# EAGLE design led-ring (EAGLE 9.4.2)
DATUM: 01.07.2019; EDITOR: Hans Achterbahn; LICENSE: MIT License; PROJEKT: LED Ring; VERSION: 0.1.0
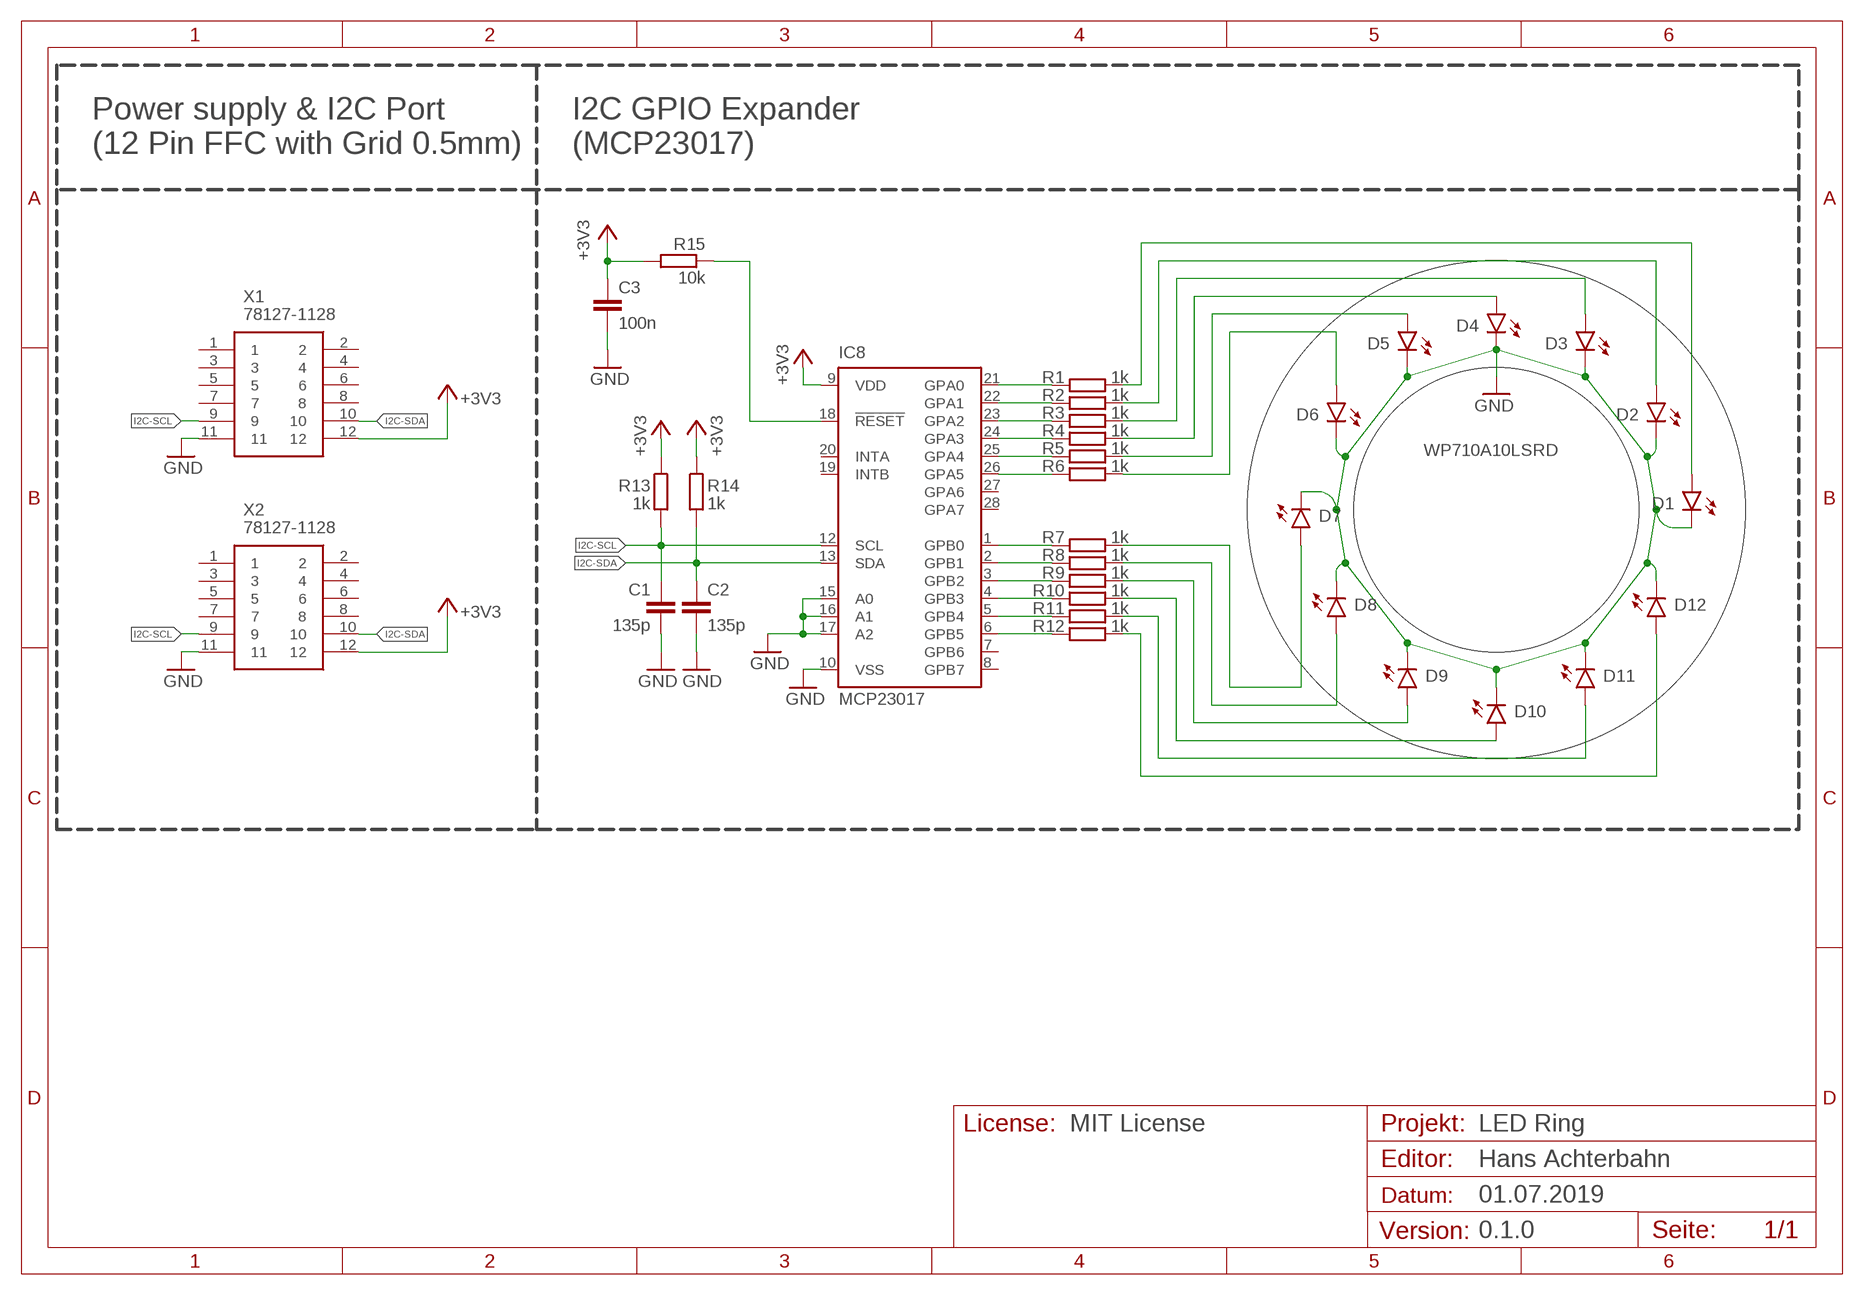
[diagram p0: schematic, sheet 1]

## Parts
C1  135p  C-EUC0603  [C0603]
C2  135p  C-EUC0603  [C0603]
C3  100n  C-EUC0603  [C0603]
D1  WP710A10LSRD  LTL-1CHE  [RADIAL_3MM]
D2  WP710A10LSRD  LTL-1CHE  [RADIAL_3MM]
D3  WP710A10LSRD  LTL-1CHE  [RADIAL_3MM]
D4  WP710A10LSRD  LTL-1CHE  [RADIAL_3MM]
D5  WP710A10LSRD  LTL-1CHE  [RADIAL_3MM]
D6  WP710A10LSRD  LTL-1CHE  [RADIAL_3MM]
D7  WP710A10LSRD  LTL-1CHE  [RADIAL_3MM]
D8  WP710A10LSRD  LTL-1CHE  [RADIAL_3MM]
D9  WP710A10LSRD  LTL-1CHE  [RADIAL_3MM]
D10  WP710A10LSRD  LTL-1CHE  [RADIAL_3MM]
D11  WP710A10LSRD  LTL-1CHE  [RADIAL_3MM]
D12  WP710A10LSRD  LTL-1CHE  [RADIAL_3MM]
IC8  MCP23017  [SOP65P780X200-28]
R1  1k  R-EU_R0603  [R0603]
R2  1k  R-EU_R0603  [R0603]
R3  1k  R-EU_R0603  [R0603]
R4  1k  R-EU_R0603  [R0603]
R5  1k  R-EU_R0603  [R0603]
R6  1k  R-EU_R0603  [R0603]
R7  1k  R-EU_R0603  [R0603]
R8  1k  R-EU_R0603  [R0603]
R9  1k  R-EU_R0603  [R0603]
R10  1k  R-EU_R0603  [R0603]
R11  1k  R-EU_R0603  [R0603]
R12  1k  R-EU_R0603  [R0603]
R13  1k  R-EU_R0603  [R0603]
R14  1k  R-EU_R0603  [R0603]
R15  10k  R-EU_R0603  [R0603]
X1  78127-1128  [781271128]
X2  78127-1128  [781271128]

## Nets
+3V3: C3.1 IC8.9(VDD) R13.1 R14.1 R15.2 X1.12 X2.12
GND: C1.2 C2.2 C3.2 D1.C D2.C D3.C D4.C D5.C D6.C D7.C D8.C D9.C D10.C D11.C D12.C IC8.10(VSS) IC8.15(A0) IC8.16(A1) IC8.17(A2) X1.11 X2.11
I2C-SCL: C1.1 IC8.12(SCL) R13.2 X1.9 X2.9
I2C-SDA: C2.1 IC8.13(SDA) R14.2 X1.10 X2.10
LED-01: D1.A R1.1
LED-02: D2.A R2.1
LED-03: D3.A R3.1
LED-04: D4.A R4.1
LED-05: D5.A R5.1
LED-06: D6.A R6.1
LED-07: D7.A R7.1
LED-08: D8.A R8.1
LED-09: D9.A R9.1
LED-10: D10.A R10.1
LED-11: D11.A R11.1
LED-12: D12.A R12.1
N$1: IC8.26(GPA5) R6.2
N$2: IC8.21(GPA0) R1.2
N$3: IC8.22(GPA1) R2.2
N$4: IC8.23(GPA2) R3.2
N$5: IC8.24(GPA3) R4.2
N$6: IC8.25(GPA4) R5.2
N$7: IC8.1(GPB0) R7.2
N$8: IC8.2(GPB1) R8.2
N$9: IC8.3(GPB2) R9.2
N$10: IC8.4(GPB3) R10.2
N$11: IC8.5(GPB4) R11.2
N$12: IC8.6(GPB5) R12.2
N$213: IC8.18(!RESET) R15.1
Unconnected: IC8.7(GPB6) IC8.8(GPB7) IC8.19(INTB) IC8.20(INTA) IC8.27(GPA6) IC8.28(GPA7) X1.1 X1.2 X1.3 X1.4 X1.5 X1.6 X1.7 X1.8 X2.1 X2.2 X2.3 X2.4 X2.5 X2.6 X2.7 X2.8

## Notes on the sheet
- Power supply & I2C Port
  (12 Pin FFC with Grid 0.5mm)
- I2C GPIO Expander
  (MCP23017)
- License:

## Library data of the parts
C1 C2 = rcl:C-EU: CAPACITOR, European symbol; SPICEPREFIX: C
C3 = rcl:C-EU: CAPACITOR, European symbol; MF: AVX; MFN: 0603YC104JAT2A; MOUSER: 581-0603YC104J; RS-ONLINE: 391-246; SPICEPREFIX: C
D1-D12 = LED:LTL-1CHE: LED RED DIFFUSED T/H Manufacturer's datasheet <https://media.digikey.com/pdf/Data%20Sheets/Lite-On%20PDFs/LTL-1CHEE.pdf>; CREATED_BY: PCBLayout.com; DIGIKEY_PART_NUMBER: 160-1708-ND; MANUFACTURER: Lite-On Inc.; MPN: LTL-1CHE; PACKAGE: RADIAL 3MM
IC8 = JS-ICs:MCP23017; MF: Microchip; MFN: MCP23017-E/SS; MOUSER: 579-MCP23017-E/SS; RS-ONLINE: 681-1128
R1-R14 = rcl:R-EU_: RESISTOR, European symbol; SPICEPREFIX: R
R15 = rcl:R-EU_: RESISTOR, European symbol; MF: Vishay; MFN: CRCW060310K0FKEA; MOUSER: 71-CRCW0603-10K-E3; RS-ONLINE: 678-9667; SPICEPREFIX: R
X1 X2 = h8-conector:78127-1128: FFC & FPC Connectors 0.5 FPC CONN. VERTIC AL SMT NON-ZIF 12CKT Source: Datasheet <https://www.molex.com/pdm_docs/sd/781271128_sd.pdf>; ALLIED_NUMBER: 70714305; ALLIED_PRICE-STOCK: https://www.alliedelec.com/molex-incorporated-78127-1128/70714305/; DESCRIPTION: FFC & FPC Connectors 0.5 FPC CONN. VERTIC AL SMT NON-ZIF 12CKT; HEIGHT: 4mm; MANUFACTURER_NAME: Molex; MANUFACTURER_PART_NUMBER: 78127-1128; MOUSER_PART_NUMBER: 538-78127-1128; MOUSER_PRICE-STOCK: https://www.mouser.com/Search/Refine.aspx?Keyword=538-78127-1128

## Net classes
0 default: width 0.2 mm, drill 0.2 mm, clearance 0.15 mm
1 Power: width 0.2 mm, drill 0.2 mm, clearance 0.15 mm

## Board
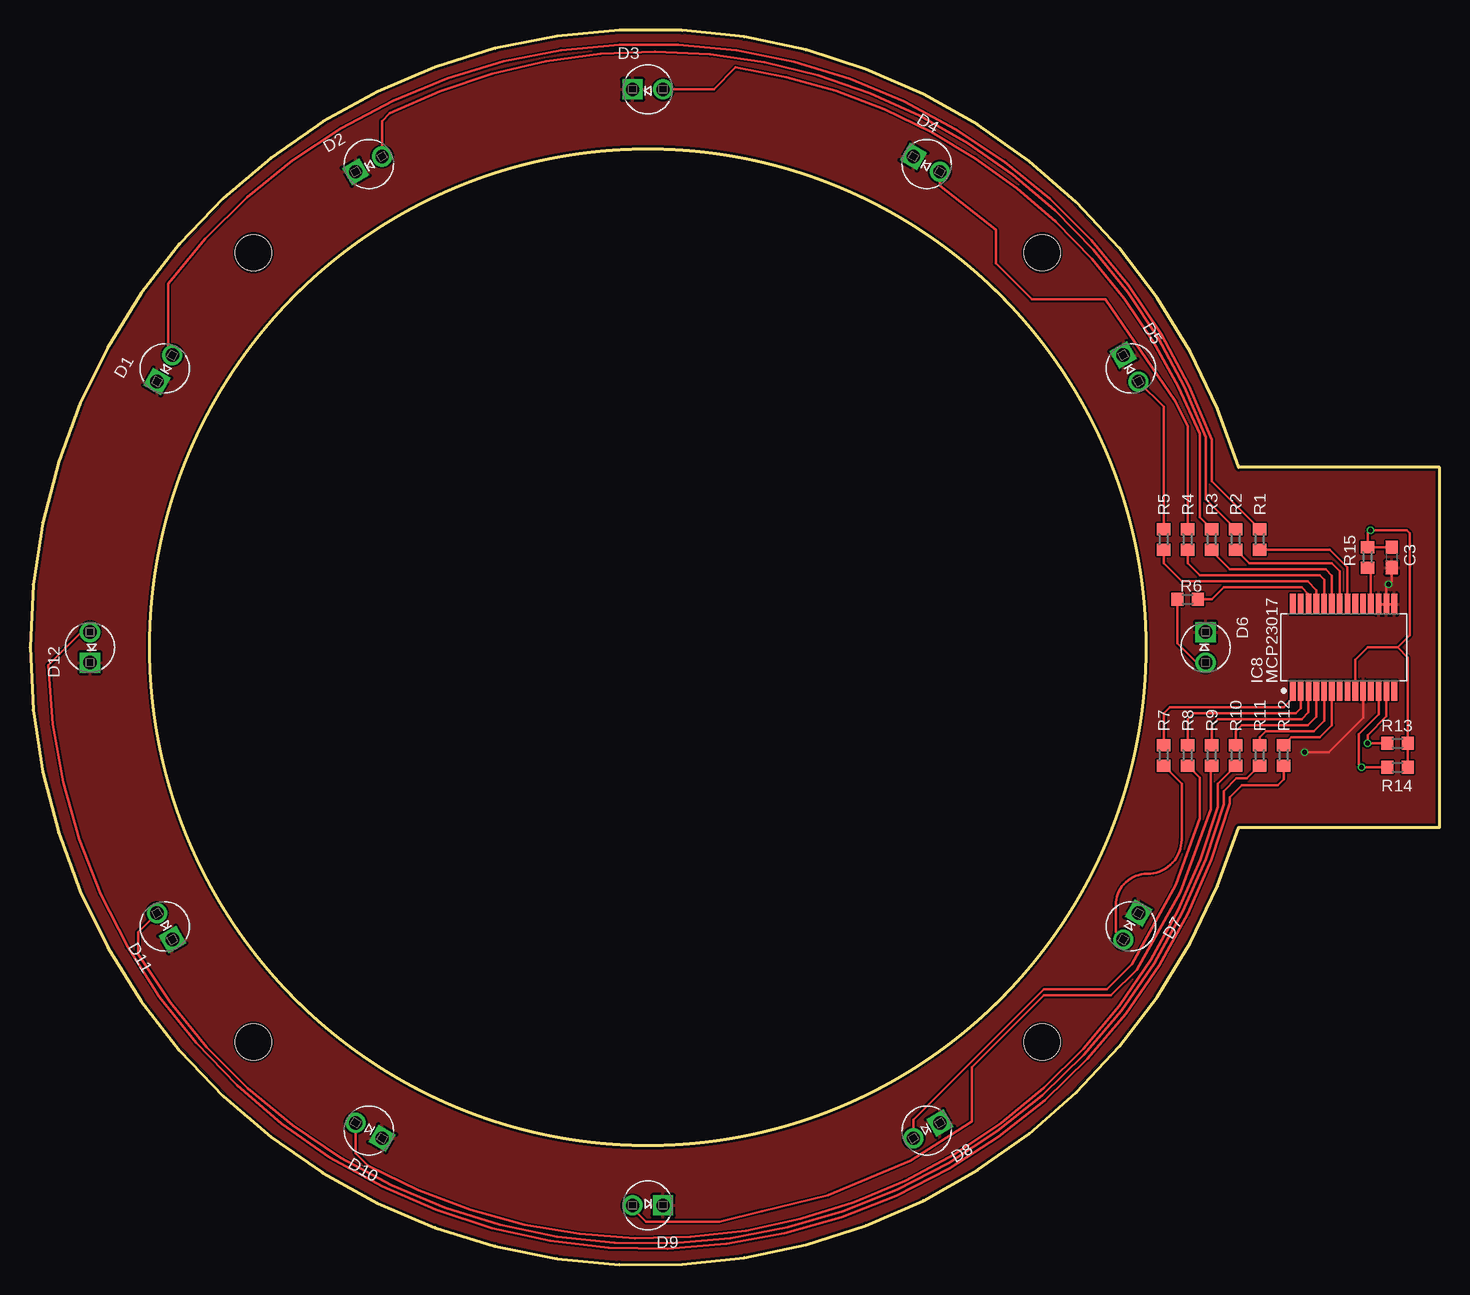
[diagram p1: board, top side]
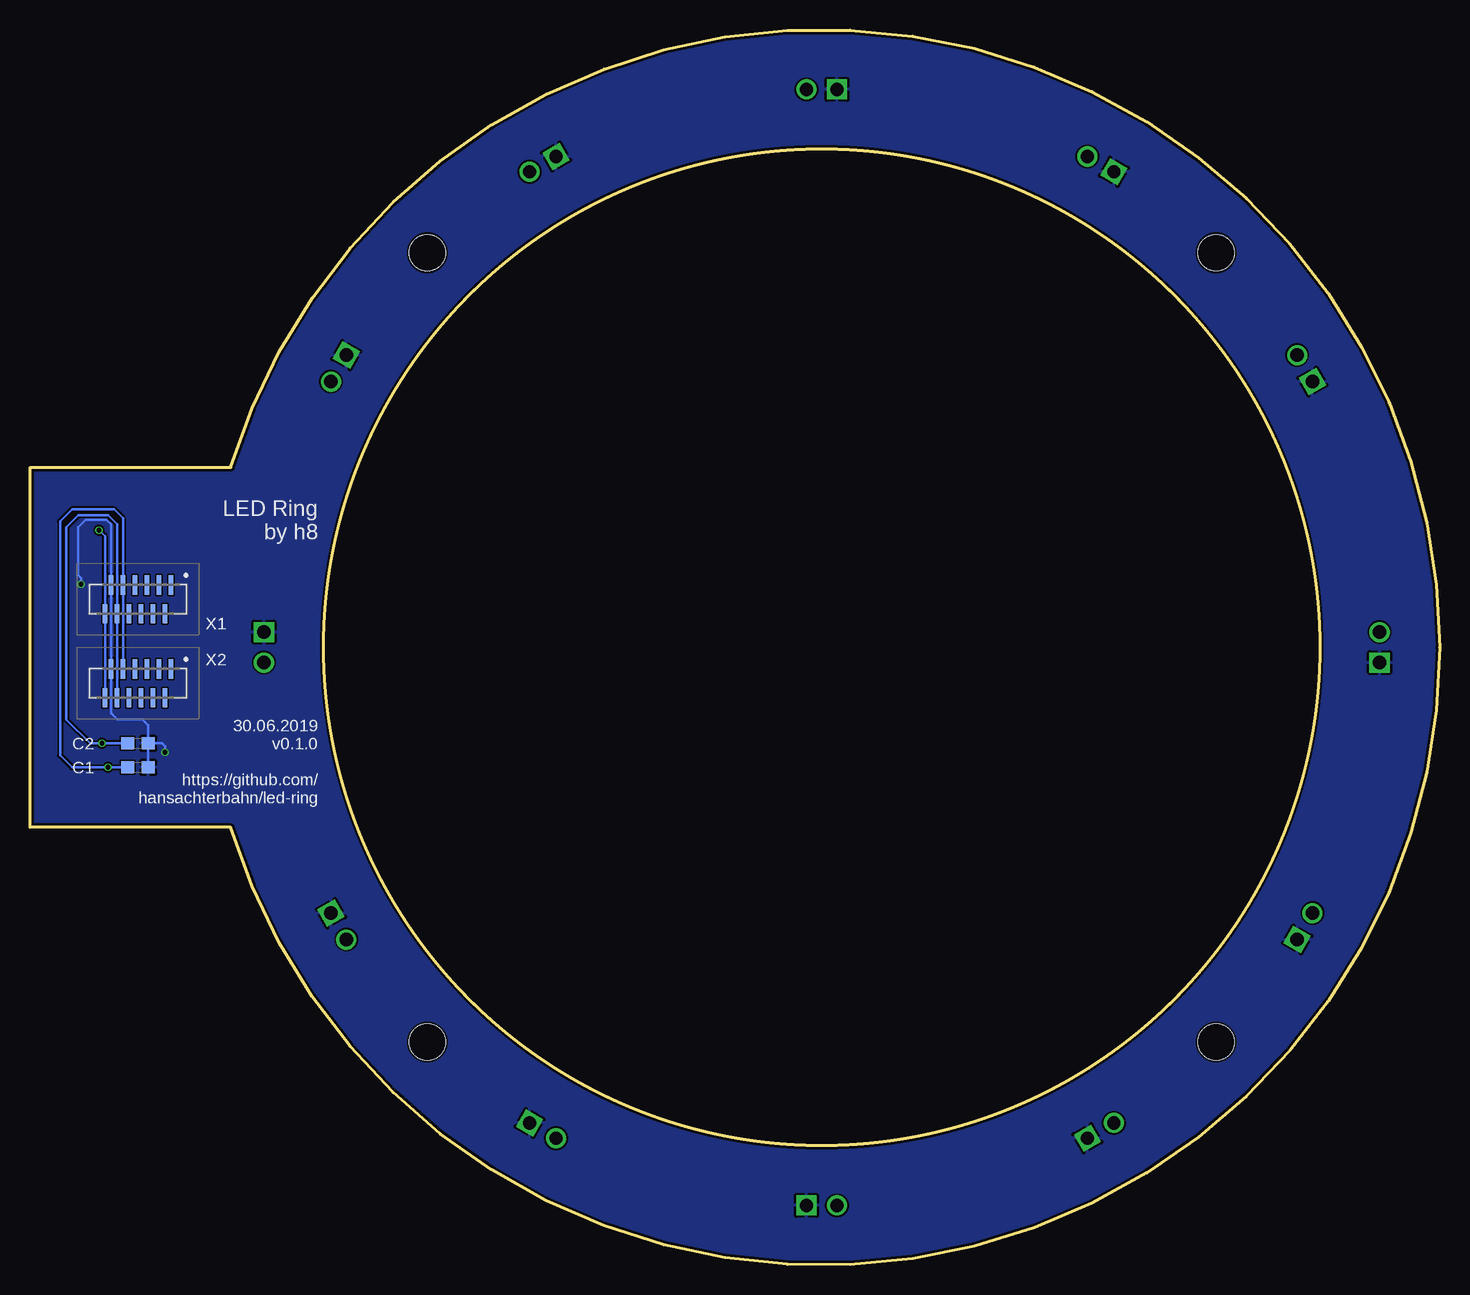
[diagram p2: board, bottom side, seen from below]

Size 117.5 x 102.89 mm. Coordinates in mm from the lower left corner, seen from the top.
Outline: 117.5,66.45 100.77,66.45 arc326 100.77,36.45 117.5,36.45 117.5,66.45
Outline: circle at 51.5,51.45 radius 41.5
Copper layers (1*16): Top 0.018mm / dielectric 1.55mm / Bottom 0.018mm
Design rules "Multi-CB_2L_100æm-Tracks_OL35æm": minimum track width 0.1mm, minimum drill 0.2mm, track to track 0.1mm, track to pad 0.1mm, pad to pad 0.1mm, via to via 0.1mm, smd to smd 0mil, copper to edge 0.2mm, drill to drill 0.2mm, minimum pad ring 0.125mm, minimum via ring 0.1mm, stop-mask expansion 2mil, vias tented up to drill 0.45mm, thermal gap 0.2mm
Holes 3 mm at 18.62,84.33 84.38,18.57 84.38,84.33 18.62,18.57

### Footprints (pad centres in the part's own frame; a part is rotated, then mirrored left to right if it is on the bottom)
C0603 = smd 1.1 x 1: 1 -0.85,0; 2 0.85,0
RADIAL_3MM = drill 1.11 pad 1.67: A 1.27,0 | drill 1.11 pad 1.67 square: C -1.27,0
SOP65P780X200-28 = smd 1.702 x 0.475: 1 -3.603,4.225; 2 -3.603,3.575; 3 -3.603,2.925; 4 -3.603,2.275; 5 -3.603,1.625; 6 -3.603,0.975; 7 -3.603,0.325; 8 -3.603,-0.325; 9 -3.603,-0.975; 10 -3.603,-1.625; 11 -3.603,-2.275; 12 -3.603,-2.925; 13 -3.603,-3.575; 14 -3.603,-4.225; 15 3.603,-4.225; 16 3.603,-3.575; 17 3.603,-2.925; 18 3.603,-2.275; 19 3.603,-1.625; 20 3.603,-0.975; 21 3.603,-0.325; 22 3.603,0.325; 23 3.603,0.975; 24 3.603,1.625; 25 3.603,2.275; 26 3.603,2.925; 27 3.603,3.575; 28 3.603,4.225
R0603 = smd 1 x 1.1: 1 -0.85,0; 2 0.85,0
781271128 = smd 0.4 x 1.6: 1 -2.75,-1.2; 2 -2.25,1.2; 3 -1.75,-1.2; 4 -1.25,1.2; 5 -0.75,-1.2; 6 -0.25,1.2; 7 0.25,-1.2; 8 0.75,1.2; 9 1.25,-1.2; 10 1.75,1.2; 11 2.25,-1.2; 12 2.75,1.2

### Placement (x,y rotation side)
C1  108.5,41.45 0 bottom
C2  108.5,43.45 0 bottom
C3  113.5,58.95 270 top
D1  11.23,74.7 60 top
D2  28.25,91.72 30 top
D3  51.5,97.95 0 top
D4  74.75,91.72 330 top
D5  91.77,74.7 300 top
D6  98,51.45 270 top
D7  91.77,28.2 240 top
D8  74.75,11.18 210 top
D9  51.5,4.95 180 top
D10  28.25,11.18 150 top
D11  11.23,28.2 120 top
D12  5,51.45 90 top
IC8  109.5,51.45 90 top
R1  102.5,60.45 270 top
R2  100.5,60.45 270 top
R3  98.5,60.45 270 top
R4  96.5,60.45 270 top
R5  94.5,60.45 270 top
R6  96.5,55.45 0 top
R7  94.5,42.45 90 top
R8  96.5,42.45 90 top
R9  98.5,42.45 90 top
R10  100.5,42.45 90 top
R11  102.5,42.45 90 top
R12  104.5,42.45 90 top
R13  114,41.45 180 top
R14  114,43.45 180 top
R15  111.5,58.95 90 top
U$1  [A4L-LOC]  -68.5,-42.55 0 top  (outside the outline)
X1  108.5,55.45 180 bottom
X2  108.5,48.45 180 bottom

### Tracks (layer width: path | path; a pad name or v marks a point on that pad's centre or on a via)
+3V3  (via drill 0.4)
  Top 0.2: C3.1 R15.2 111.5,60.95 v111.75,61.2 114.75,61.2 115,60.95 115,52.45 114,51.45 | IC8.9 110.48,50.42 111.5,51.45 114,51.45 | R13.1 R14.1 114.85,50.6 114,51.45
  Bottom 0.2: X2.12 X1.12 111.25,60.7 v111.75,61.2
GND  (via drill 0.4)
  Top 0.2: 113.5,57.95 C3.2 113.5,56.95 v113.25,56.7 113.08,56.52 IC8.16 | IC8.10 111.13,45.57 108.25,42.7 v106.25,42.7 | IC8.17 IC8.16 | IC8.16 IC8.15
  Bottom 0.2: C1.2 C2.2 | C2.2 107.65,44.95 108.15,45.45 110.25,45.45 110.75,45.95 X2.11 X1.11 110.75,61.7 111.15,62.09 112.85,62.09 113.5,61.45 113.5,57.45 113.25,57.2 v113.25,56.7 | v106.25,42.7 106.25,43.2 106.5,43.45 C2.2
  pour Bottom: -3.5,106.45 -3.5,-3.55 121.5,-3.55 121.5,106.45
  pour Top: -3.5,106.45 -3.5,-3.55 121.5,-3.55 121.5,106.45
I2C-SCL  (via drill 0.4)
  Top 0.2: IC8.12 112.43,45.87 110.75,44.2 110.75,41.7 v111,41.45 R13.2
  Bottom 0.2: X2.9 X1.9 109.75,62.2 110.5,62.95 114,62.95 115,61.95 115,42.45 114,41.45 v111,41.45 C1.1
I2C-SDA  (via drill 0.4)
  Top 0.2: IC8.13 113.08,45.7 111.5,44.12 v111.5,43.45 R14.2
  Bottom 0.2: X2.10 X1.10 110.25,61.7 111,62.45 113.5,62.45 114.48,61.46 114.48,45.43 112.5,43.45 v111.5,43.45 C2.1
LED-01
  Top 0.2: D1.A 11.5,76.16 11.5,81.74 arc-123 98.5,68.74 98.5,65.3 R1.1
LED-02
  Top 0.2: D2.A 29.35,95.3 30,95.94 arc-96 98,68.94 98,63.8 R2.1
LED-03
  Top 0.2: D3.A 57,97.95 58.82,99.77 arc-60 97.5,69.23 97.5,62.3 R3.1
LED-04
  Top 0.2: D4.A 75.85,89.93 80.5,86.26 80.5,83.45 83.5,80.45 89.66,80.45 95.5,71.94 96.5,69.88 R4.1
LED-05
  Top 0.2: R5.1 94.5,71.5 D5.A
LED-06
  Top 0.2: R6.1 95.65,51.8 97.27,50.18 D6.A
LED-07
  Top 0.2: D7.A 90.5,27.73 90.5,29.95 arc-90 93.13,32.57 arc90 96,35.45 96,40.1 R7.1
LED-08
  Top 0.2: D8.A 73.65,12.1 84.5,22.95 89.77,22.95 91.85,25.03 95.53,31.66 97.5,37.19 97.5,40.6 R8.1
LED-09
  Top 0.2: D9.A 50.23,4.72 51.35,3.6 57.46,3.6 61,4.45 66.54,5.78 73.4,8.68 78.37,11.82 78.5,11.95 78.5,16.45 84.5,22.45 90.12,22.45 92.26,24.58 95.91,31.04 98.45,37.96 98.45,41.55 R9.1
LED-10
  Top 0.2: D10.A 27.15,9.3 28.2,8.24 arc103 99,38.16 99,40.1 R10.1
LED-11
  Top 0.2: D11.A 9,27.7 9,25.88 arc134 99.5,38.38 99.5,39.45 100.58,40.52 101.43,40.52 R11.1
LED-12
  Top 0.2: D12.A 4.27,52.72 1.5,49.95 arc163 100,38.45 100,38.95 101,39.95 104,39.95 104.5,40.45 R12.1
N$1
  Top 0.2: IC8.26 106.58,55.87 106,56.45 99.5,56.45 98.5,55.45 R6.2
N$2
  Top 0.2: R1.2 108.35,59.6 109.83,58.12 IC8.21
N$3
  Top 0.2: R2.2 101.65,58.45 108.5,58.45 109.18,57.77 IC8.22
N$4
  Top 0.2: IC8.23 108.53,57.42 108,57.95 100,57.95 98.5,59.45 R3.2
N$5
  Top 0.2: IC8.24 107.88,57.07 107.5,57.45 97.5,57.45 96.5,58.45 R4.2
N$6
  Top 0.2: IC8.25 107.23,56.22 106.5,56.95 96,56.95 94.5,58.45 R5.2
N$7
  Top 0.2: IC8.1 105.28,47.22 104.5,46.45 95,46.45 94.5,45.95 R7.2
N$8
  Top 0.2: IC8.2 105.93,46.37 105.5,45.95 97,45.95 96.5,45.45 R8.2
N$9
  Top 0.2: IC8.3 106.58,46.02 106,45.45 99,45.45 98.5,44.95 R9.2
N$10
  Top 0.2: IC8.4 107.23,45.67 106.5,44.95 101,44.95 100.5,44.45 R10.2
N$11
  Top 0.2: IC8.5 107.88,45.32 107,44.45 103,44.45 102.5,43.95 R11.2
N$12
  Top 0.2: IC8.6 108.53,44.97 107.5,43.95 105.15,43.95 R12.2
N$213
  Top 0.2: IC8.18 111.78,57.82 R15.1

### Text on the board
bNames: LED Ring / by h8 | 30.06.2019 / v0.1.0 / / https://github.com/ / hansachterbahn/led-ring